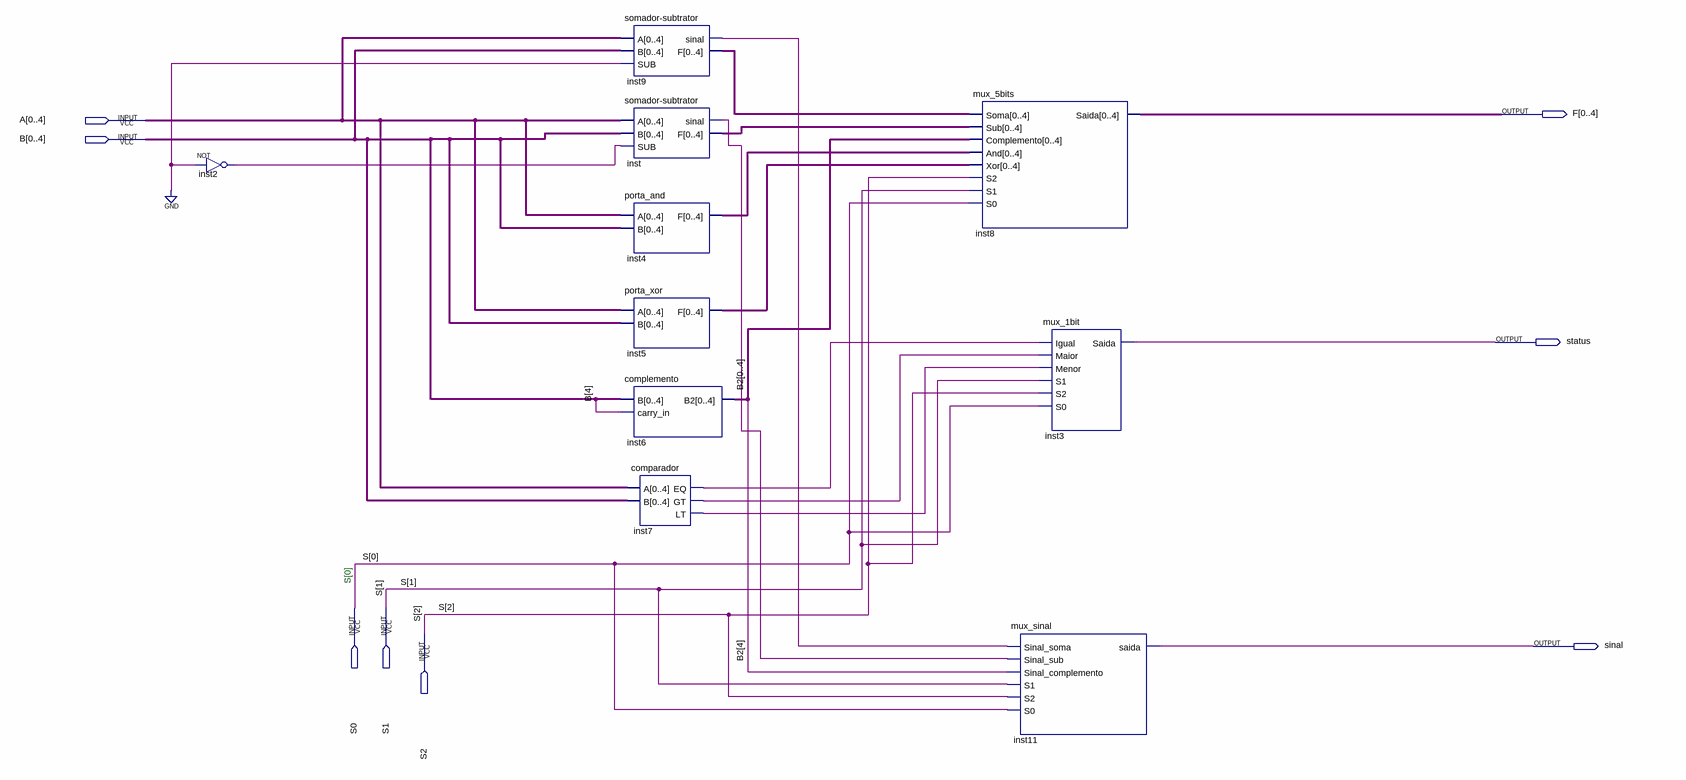
[diagram p0: schematic sheet]
// Quartus schematic ULA.bdf as structural Verilog: 10 symbols, 8 pins
module ULA (
  input  [0:4] A,
  input  [0:4] B,
  input  S0,
  input  S1,
  input  S2,
  output [0:4] F,
  output status,
  output sinal
);

  wire inst2_out, inst7_eq, inst7_gt, inst7_lt, inst9_sinal, inst_sinal;
  wire [4:0] B2, inst4_f, inst5_f, inst9_f, inst_f;

  not inst2 (inst2_out, 1'b0);
  \somador-subtrator  inst9 (.A(A), .B(B), .SUB(1'b0), .sinal(inst9_sinal), .F(inst9_f));
  \somador-subtrator  inst (.A(A), .B(B), .SUB(inst2_out), .sinal(inst_sinal), .F(inst_f));
  porta_and inst4 (.A(A), .B(B), .F(inst4_f));
  porta_xor inst5 (.A(A), .B(B), .F(inst5_f));
  complemento inst6 (.B(B), .carry_in(B[4]), .B2({B2[0], B2[1], B2[2], B2[3], B2[4]}));
  comparador inst7 (.A(A), .B(B), .EQ(inst7_eq), .GT(inst7_gt), .LT(inst7_lt));
  mux_5bits inst8 (
    .Soma(inst9_f), .Sub(inst_f), .Complemento({B2[0], B2[1], B2[2], B2[3], B2[4]}), .And(inst4_f),
    .Xor(inst5_f), .S2(S2), .S1(S1), .S0(S0), .Saida(F));
  mux_sinal inst11 (
    .Sinal_soma(inst9_sinal), .Sinal_sub(inst_sinal), .Sinal_complemento(B2[4]), .S1(S1), .S2(S2), .S0(S0),
    .saida(sinal));
  mux_1bit inst3 (.Igual(inst7_eq), .Maior(inst7_gt), .Menor(inst7_lt), .S1(S1), .S2(S2), .S0(S0), .Saida(status));

  // Notes on the sheet:
  //   S[0]
endmodule
